# EAGLE design Lights (EAGLE 9.6.2)
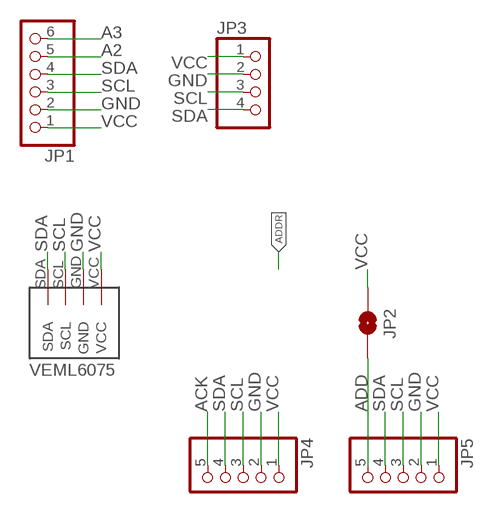
[diagram p0: schematic, sheet 1]

## Parts
JP1  PINHD-1X6  [1X06]
JP2  JUMPER-SMT_2_NO_SILK  [SMT-JUMPER_2_NO_SILK]
JP3  PINHD-1X4  [1X04]
JP4  PINHD-1X5  [1X05]
JP5  PINHD-1X5  [1X05]
U$2  VEML6075  [VEML6075]

## Nets
A2: JP1.5
A3: JP1.6
ACK: JP4.5
ADD: JP2.1 JP5.5
GND: JP1.2 JP3.2 JP4.2 JP5.2 U$2.GND
SCL: JP1.3 JP3.3 JP4.3 JP5.3 U$2.SCL
SDA: JP1.4 JP3.4 JP4.4 JP5.4 U$2.SDA
VCC: JP1.1 JP2.2 JP3.1 JP4.1 JP5.1 U$2.VCC

## Library data of the parts
JP1 = pinhead:PINHD-1X6: PIN HEADER
JP2 = SparkFun-Jumpers:JUMPER-SMT_2_NO: Normally open jumper This jumper has two pads in close proximity to each other. Apply solder to close the connection. Round pads are easier to solder for beginners, but are a lot larger. SparkFun Product that uses the round pads: SparkFun EL Sequencer <https://www.sparkfun.com/products/12781>
JP3 = pinhead:PINHD-1X4: PIN HEADER
JP4 JP5 = pinhead:PINHD-1X5: PIN HEADER
U$2 = Breakout-sensors:VEML6075

## Board
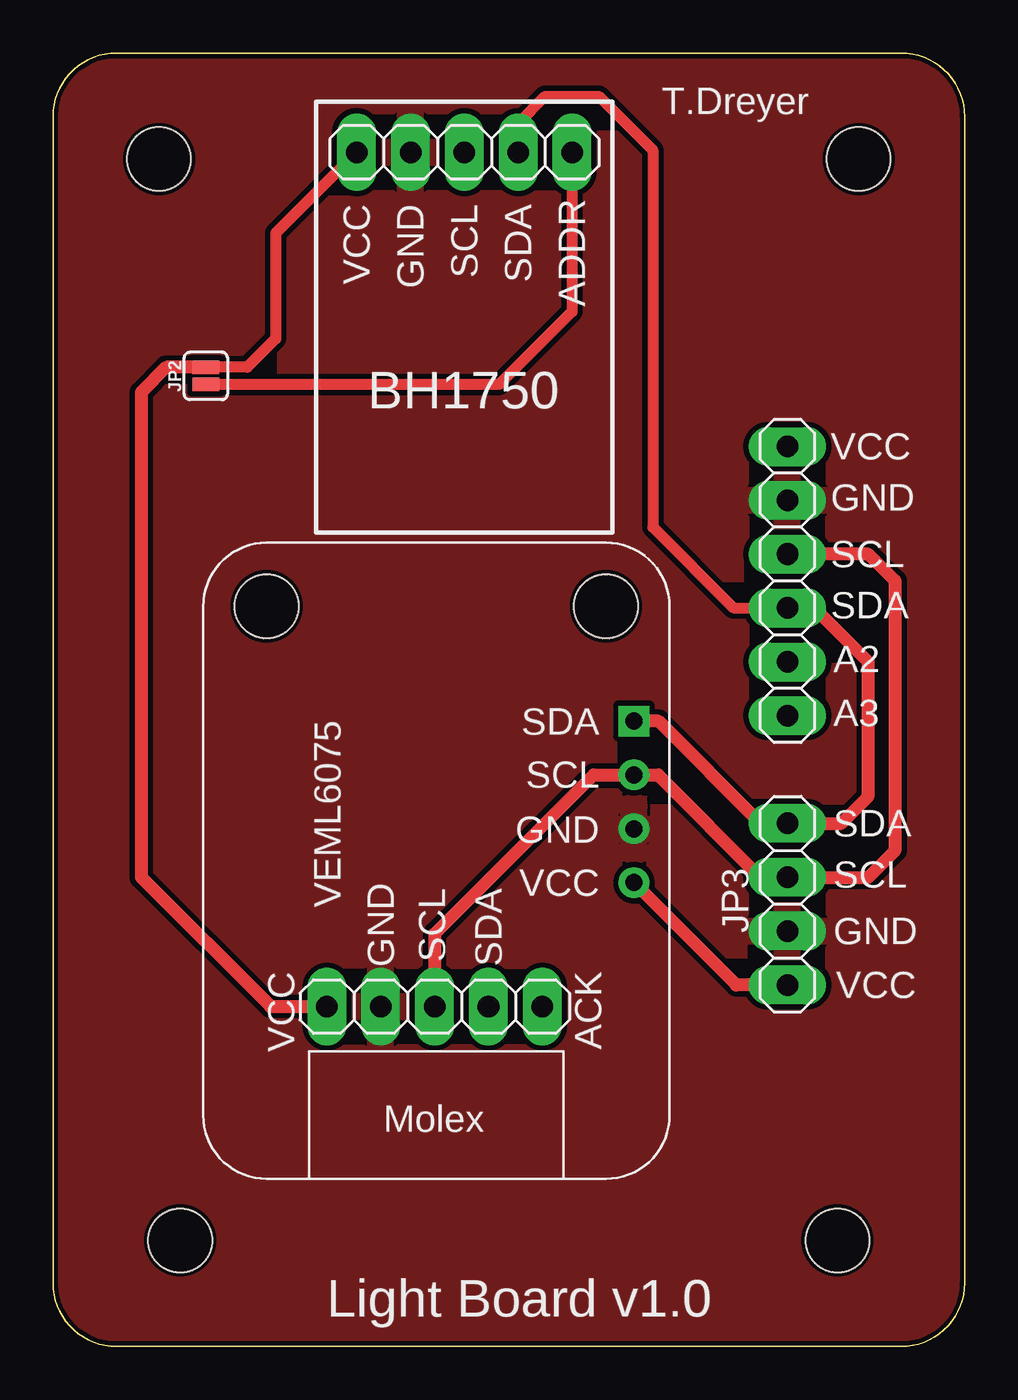
[diagram p1: board, top side]
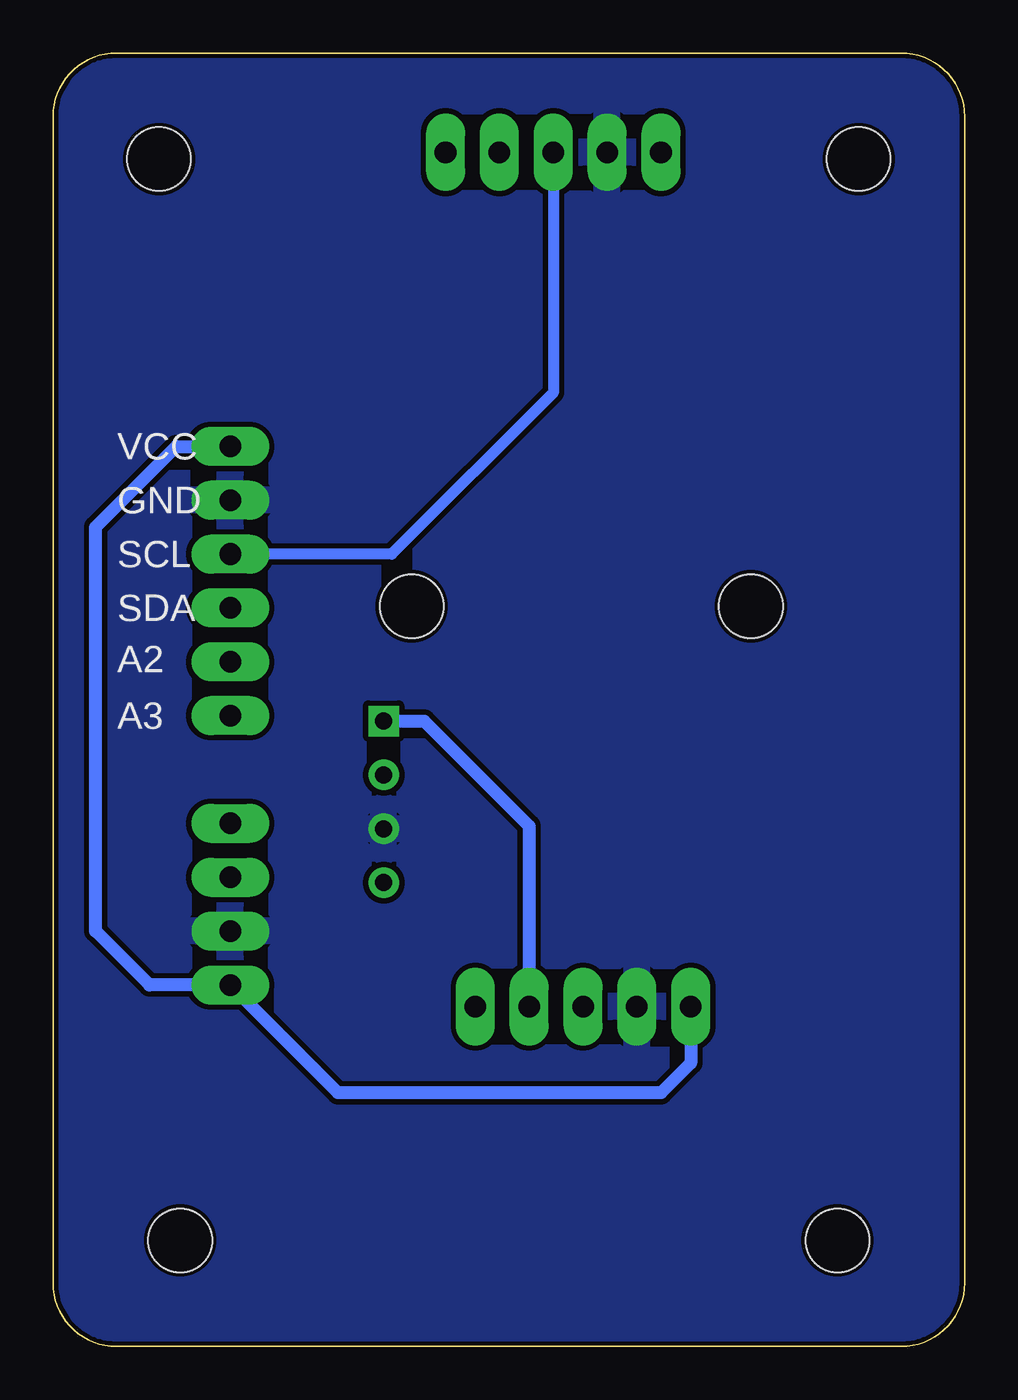
[diagram p2: board, bottom side, seen from below]

Size 43 x 61 mm. Coordinates in mm from the lower left corner, seen from the top.
Outline: 3,61 40,61 arc-90 43,58 43,3 arc-90 40,0 3,0 arc-90 0,3 0,58 arc-90 3,61
Copper layers (1*16): Top 0.035mm / dielectric 1.6mm / Bottom 0.035mm
Design rules "jlcpcb-2layers *": minimum track width 5mil, minimum drill 0.3mm, track to track 10mil, track to pad 5mil, pad to pad 5mil, via to via 5mil, smd to smd 5mil, copper to edge 0.2mm, drill to drill 6mil, minimum pad ring 10mil, minimum via ring 3mil, stop-mask expansion 4mil, vias tented up to drill 16mil, thermal gap 10mil
Holes 3 mm at 5,56 38,56 6,5 37,5

### Footprints (pad centres in the part's own frame; a part is rotated, then mirrored left to right if it is on the bottom)
1X06 = drill 1.016 long: 1 -6.35,0; 2 -3.81,0; 3 -1.27,0; 4 1.27,0; 5 3.81,0; 6 6.35,0
SMT-JUMPER_2_NO_SILK = smd 0.635 x 1.27: 1 -0.406,0; 2 0.406,0
1X04 = drill 1.016 long: 1 -3.81,0; 2 -1.27,0; 3 1.27,0; 4 3.81,0
1X05 = drill 1.016 long: 1 -5.08,0; 2 -2.54,0; 3 0,0; 4 2.54,0; 5 5.08,0
VEML6075 = drill 0.8: GND 20.32,16.51; SCL 20.32,19.05; VCC 20.32,13.97 | drill 0.8 square: SDA 20.32,21.59 | hole 3: 3,27; 19,27

### Placement (x,y rotation side)
JP1  34.64,36.1 270 top
JP2  7.21,45.77 90 top
JP3  34.64,20.86 90 top
JP4  18,16.03 0 top
JP5  19.41,56.32 0 top
U$2  7.08,7.91 0 top

### Tracks (layer width: path | path; a pad name or v marks a point on that pad's centre or on a via)
ADD
  Top 0.508: JP5.5 24.48,48.8 21.04,45.36 JP2.1
GND
  pour Top: -4.73,62.77 44.8,62.77 44.8,-3.27 -4.73,-3.27
  pour Bottom: -7.27,65.31 47.34,65.31 47.34,-7.08 -7.27,-7.08
SCL
  Top 0.61: JP1.3 38.45,37.37 39.72,36.1 39.72,23.4 38.45,22.13 JP3.3 33.37,22.13 28.54,26.96 U$2.SCL 25.5,26.96 18,19.46 JP4.3
  Bottom 0.508: JP5.3 19.41,44.98 27.02,37.37 JP1.3
SDA
  Top 0.508: JP5.4 21.95,57.7 23.21,58.96 25.75,58.96 28.29,56.42 28.29,38.64 32.1,34.83 JP1.4
  Top 0.61: JP1.4 35.91,34.83 38.45,32.29 38.45,25.94 37.18,24.67 JP3.4 33.37,24.67 28.54,29.5 U$2.SDA
  Bottom 0.61: U$2.SDA 25.5,29.5 20.54,24.54 JP4.4
VCC
  Top 0.508: JP5.1 10.51,52.51 10.51,47.53 9.16,46.18 JP2.2
  Top 0.61: JP3.1 32.23,17.05 U$2.VCC | JP2.2 5.35,46.18 4.16,44.99 4.16,22.13 10.26,16.03 JP4.1
  Bottom 0.61: JP1.1 37.18,42.45 40.99,38.64 40.99,19.59 38.45,17.05 JP3.1 29.56,11.97 14.32,11.97 12.92,13.37 JP4.1

### Text on the board
tPlace: T.Dreyer | VCC | GND | SCL | SDA | ADDR | BH1750 | VCC | GND | SCL | SDA | A2 | A3 | SDA | GND | SCL | SDA | SCL | GND | VCC | ACK | VCC | Light Board v1.0
bPlace: VCC | GND | SCL | SDA | A2 | A3